# EAGLE design Stepper Brd9Maybefinal (EAGLE 7.5.0)
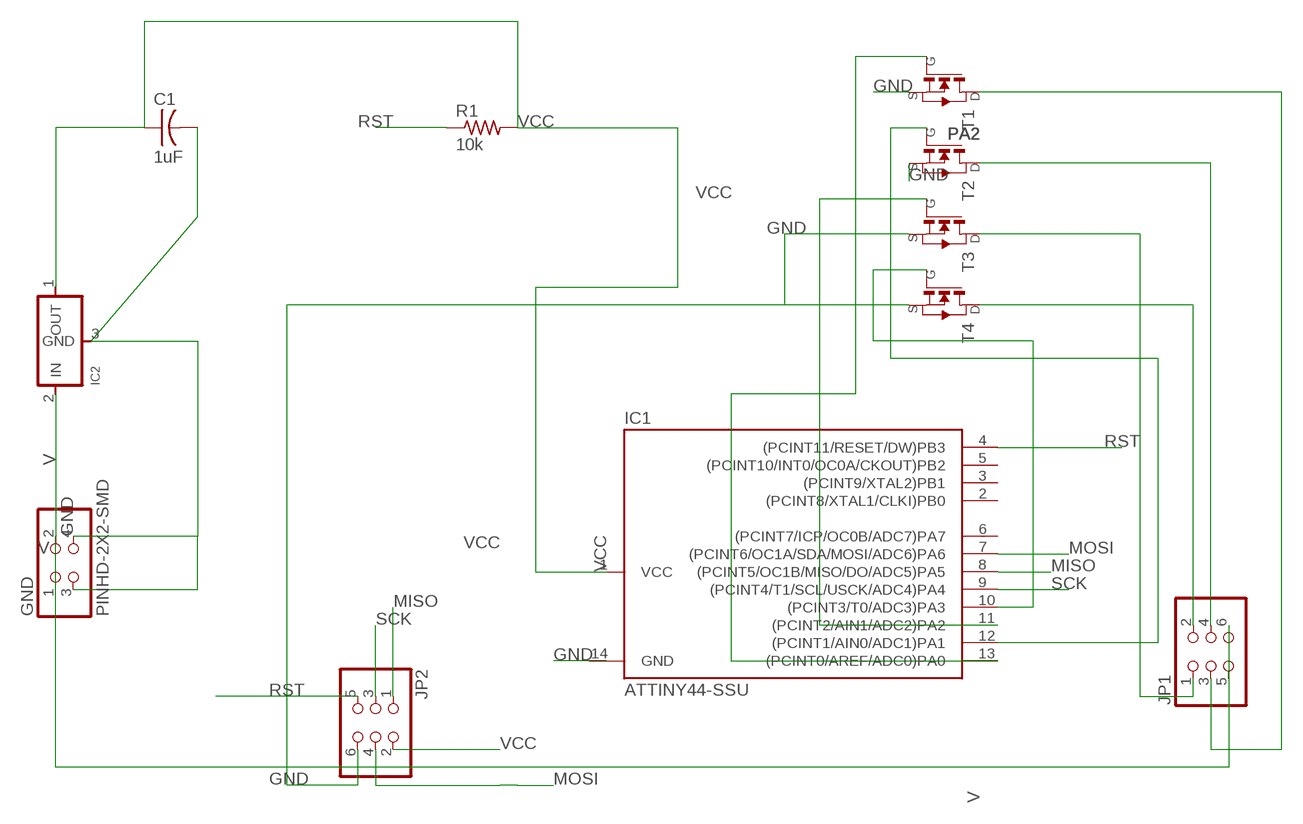
[diagram p0: schematic, sheet 1]

## Parts
C1  1uF  CAP-US1206FAB  [C1206FAB]
GND  PINHD-2X2-SMD  [2X02SMD]
IC1  ATTINY44-SSU  [SOIC14]
IC2  REGULATORSOT23  [SOT23]
JP1  PINHD-2X3-SMD  [2X03SMD]
JP2  PINHD-2X3-SMD  [2X03SMD]
R1  10k  RES-US1206FAB  [R1206FAB]
T1  NMOSFETSOT23  [SOT-23]
T2  NMOSFETSOT23  [SOT-23]
T3  NMOSFETSOT23  [SOT-23]
T4  NMOSFETSOT23  [SOT-23]

## Nets
GND: C1.2 GND.3 GND.4 IC2.3(GND) JP2.6 T1.2(S) T2.2(S) T3.2(S) T4.2(S)
MISO: IC1.8((PCINT5/OC1B/MISO/DO/ADC5)PA5) JP2.1
MOSI: IC1.7((PCINT6/OC1A/SDA/MOSI/ADC6)PA6) JP2.4
N$1: IC1.10((PCINT3/T0/ADC3)PA3) T4.3(G)
N$2: IC1.11((PCINT2/AIN1/ADC2)PA2) T3.3(G)
N$5: JP1.2 T4.1(D)
N$6: JP1.4 T2.1(D)
N$7: JP1.1 T3.1(D)
N$8: JP1.3 T1.1(D)
N$9: IC1.13((PCINT0/AREF/ADC0)PA0) T1.3(G)
PA2: IC1.12((PCINT1/AIN0/ADC1)PA1) T2.3(G)
RST: IC1.4((PCINT11/RESET/DW)PB3) JP2.5 R1.1
SCK: IC1.9((PCINT4/T1/SCL/USCK/ADC4)PA4) JP2.3
V: GND.1 GND.2 IC2.2(IN) JP1.5 JP1.6
VCC: C1.1 IC1.1(VCC) IC2.1(OUT) JP2.2 R1.2
Unconnected: IC1.2((PCINT8/XTAL1/CLKI)PB0) IC1.3((PCINT9/XTAL2)PB1) IC1.5((PCINT10/INT0/OC0A/CKOUT)PB2) IC1.6((PCINT7/ICP/OC0B/ADC7)PA7)

## Power pins joined to a net without a drawn wire
GND: IC1.14(GND)

## Library data of the parts
C1 = fab:CAP-US
GND = fab:PINHD-2X2-SMD
IC1 = fab:ATTINY44
IC2 = fab:REGULATOR
JP1 JP2 = fab:PINHD-2X3-SMD: PIN HEADER
R1 = fab:RES-US: Resistor (US Symbol) Variants with postfix FAB are widened to allow the routing of internal traces
T1-T4 = fab:NMOSFET: MOS FET

## Board
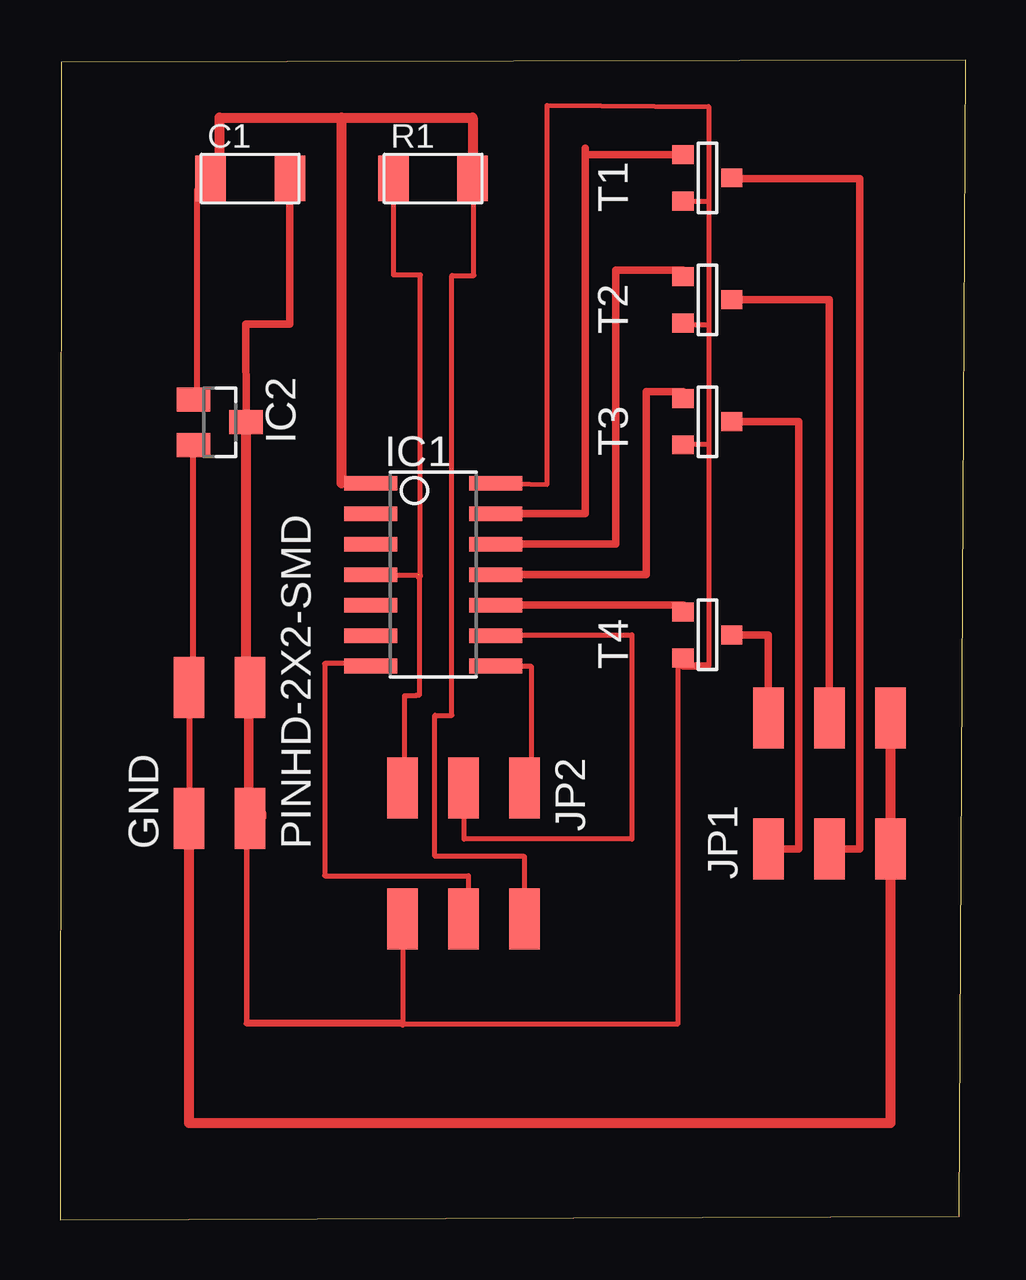
[diagram p1: board, top side]

Size 37.74 x 48.35 mm. Coordinates in mm from the lower left corner, seen from the top.
Outline: 0,0 37.46,0.15 37.74,48.35 0.05,48.25 0,0
Copper layers (1*16): Top 0.035mm / dielectric 1.5mm / Bottom 0.035mm
Design rules "default": minimum track width 10mil, minimum drill 24mil, track to track 8mil, track to pad 8mil, pad to pad 8mil, via to via 8mil, smd to smd 8mil, copper to edge 40mil, drill to drill 8mil, minimum pad ring 10mil, minimum via ring 8mil, stop-mask expansion 4mil, vias tented up to drill 0mil, thermal gap 10mil

### Footprints (pad centres in the part's own frame; a part is rotated, then mirrored left to right if it is on the bottom)
C1206FAB = smd 1.27 x 1.905: 1 -1.651,0; 2 1.651,0
2X02SMD = smd 2.54 x 1.27: 1 -2.54,1.27; 2 2.92,1.27; 3 -2.54,-1.27; 4 2.92,-1.27
SOIC14 = smd 0.61 x 2.21: 1 -3.81,-2.603; 2 -2.54,-2.603; 3 -1.27,-2.603; 4 0,-2.603; 5 1.27,-2.603; 6 2.54,-2.603; 7 3.81,-2.603; 8 3.81,2.603; 9 2.54,2.603; 10 1.27,2.603; 11 0,2.603; 12 -1.27,2.603; 13 -2.54,2.603; 14 -3.81,2.603
SOT23 = smd 1 x 1.4: 1 -0.95,-1.1; 2 0.95,-1.1; 3 0,1.1
2X03SMD = smd 2.54 x 1.27: 1 -2.54,2.54; 2 2.92,2.54; 3 -2.54,0; 4 2.92,0; 5 -2.54,-2.54; 6 2.92,-2.54
R1206FAB = smd 1.27 x 1.905: 1 -1.651,0; 2 1.651,0
SOT-23 = smd 0.787 x 0.889: 1 0.025,-1.016; 2 -0.94,1.016; 3 0.991,1.016

### Placement (x,y rotation side)
C1  7.92,43.41 0 top
GND  6.65,19.28 90 top
IC1  15.54,26.9 270 top
IC2  6.65,33.25 270 top
JP1  32.05,18.01 90 top
JP2  16.81,15.47 270 top
R1  15.54,43.41 0 top
T1  26.97,43.41 90 top
T2  26.97,38.33 90 top
T3  26.97,33.25 90 top
T4  26.97,24.36 90 top

### Tracks (layer width: path | path; a pad name or v marks a point on that pad's centre or on a via)
GND
  Top 0.203: IC1.14 20.29,30.66 20.29,46.46 27.03,46.41 27.03,42.47 | 27.03,42.47 27.03,37.31 | 27.03,37.31 27.03,32.33 | 27.03,23.04 26.34,23.09 | T3.2 25.96,32.33 27.03,32.33 | T2.2 25.96,37.31 27.03,37.31 | T1.2 27.03,42.47 | JP2.6 14.27,8.13 14.3,8.13 14.3,8.23 7.8,8.23 7.8,16.99 8.48,16.99 8.48,16.74 GND.3 | IC2.3 7.75,8.18 25.76,8.18 25.76,23.42 T4.2 | 27.03,32.33 27.03,23.09 26.97,23.09
  Top 0.254: GND.4 GND.3
  Top 0.305: 26.97,23.09 26.34,23.09 25.96,23.09 T4.2 | C1.2 9.58,37.34 7.75,37.34 IC2.3
  Top 0.406: GND.4 7.75,22.2 IC2.3
MISO
  Top 0.203: IC1.8 19.63,23.09 19.63,18.01 JP2.1
MOSI
  Top 0.203: IC1.7 12.94,23.19 11.02,23.19 11.02,14.35 17.02,14.35 17.02,12.55 JP2.4
N$1
  Top 0.305: IC1.10 25.96,25.63 T4.3
N$2
  Top 0.305: IC1.11 24.43,26.9 24.43,34.52 25.96,34.52 T3.3
N$5
  Top 0.305: T4.1 29.51,24.38 JP1.2
N$6
  Top 0.305: T2.1 32.05,38.35 JP1.4
N$7
  Top 0.305: T3.1 30.78,33.27 30.78,15.47 JP1.1
N$8
  Top 0.305: JP1.3 33.32,15.47 33.32,43.41 27.99,43.41 T1.1
N$9
  Top 0.305: T1.3 21.89,44.4 | 21.89,44.4 21.89,44.68 | 21.89,44.4 21.89,29.44 IC1.13
PA2
  Top 0.305: IC1.12 23.16,28.17 23.16,39.6 25.96,39.6 T2.3
RST  (1 unrouted)
  Top 0.203: 14.96,26.87 14.96,21.87 14.83,21.87 14.83,21.84 14.35,21.84 14.35,18.01 JP2.5 | 15.01,26.82 15.01,26.87 | 15.01,26.87 14.93,26.87 | 14.93,26.87 14.93,26.77 | 15.01,26.87 15.01,39.4 13.89,39.4 R1.1 | IC1.4 12.94,26.87 14.93,26.87
SCK
  Top 0.203: IC1.9 18.15,24.38 23.82,24.38 23.82,15.87 16.84,15.87 16.84,18.01 JP2.3
  Top 0.254: 18.72,24.36 IC1.9
V
  Top 0.254: IC2.2 5.54,32.3 5.54,22.45 5.38,22.29 GND.2 GND.1
  Top 0.406: JP1.5 JP1.6 34.59,4.04 5.38,4.04 GND.1
VCC
  Top 0.203: JP2.2 19.35,15.14 19.3,15.14 19.3,15.16 15.62,15.16 15.62,21.03 16.33,21.03 16.33,39.37 17.25,39.37 17.25,43.41 R1.2
  Top 0.254: IC2.1 5.7,34.2 5.7,42.93 6.18,43.41 C1.1
  Top 0.406: C1.1 6.65,43.41 6.65,45.95 11.73,45.95 | 11.73,45.95 17.2,45.95 R1.2 | IC1.1 11.73,30.71 11.73,45.95